# EAGLE design communication_singleSided (EAGLE 5.03)
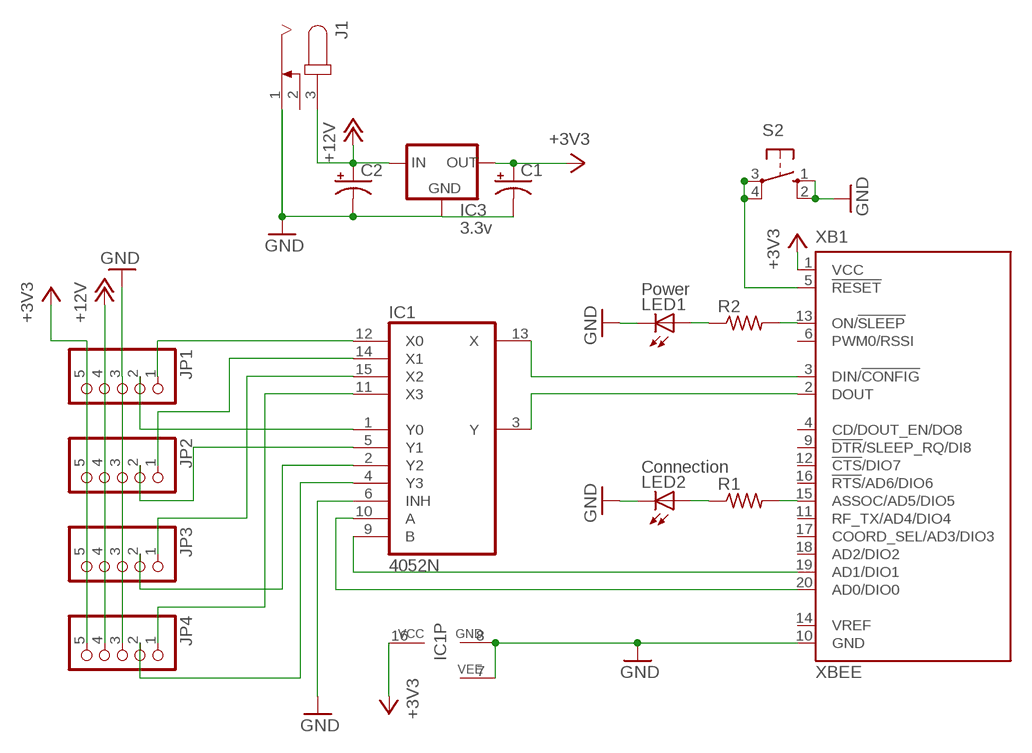
[diagram p0: schematic, sheet 1]

## Parts
C1  CPOL-USE2.5-5  [E2,5-5]
C2  CPOL-USE2.5-5  [E2,5-5]
IC1  4052N  [DIL16]
IC3  3.3v  78XXS  [78XXS]
J1  JACK-PLUG1  [SPC4078]
JP1  PINHD-1X5  [1X05]
JP2  PINHD-1X5  [1X05]
JP3  PINHD-1X5  [1X05]
JP4  PINHD-1X5  [1X05]
LED1  Power  LED3MM  [LED3MM]
LED2  Connection  LED3MM  [LED3MM]
R1  R-US_0207/10  [0207/10]
R2  R-US_0207/10  [0207/10]
S2  10-XX  [B3F-10XX]
XB1  XBEE  [XBEE]

## Nets
+3V3: C1.+ IC1.16(VCC) IC3.OUT JP1.5 JP2.5 JP3.5 JP4.5 XB1.1(VCC)
+12V: C2.+ IC3.IN J1.3 JP1.4 JP2.4 JP3.4 JP4.4
GND: C1.- C2.- IC1.6(INH) IC1.7(VEE) IC1.8(GND) IC3.GND J1.1 JP1.3 JP2.3 JP3.3 JP4.3 LED1.K(C) LED2.K(C) S2.1(S) S2.2(S1) XB1.10(GND)
N$3: IC1.12(X0) JP1.1
N$4: R1.2 XB1.15(ASSOC/AD5/DIO5)
N$5: LED2.A R1.1
N$6: R2.2 XB1.13(ON/!SLEEP)
N$7: LED1.A R2.1
N$8: S2.3(P) S2.4(P1) XB1.5(!RESET)
N$9: IC1.14(X1) JP2.1
N$11: IC1.15(X2) JP3.1
N$12: IC1.11(X3) JP4.1
N$13: IC1.5(Y1) JP2.2
N$14: IC1.1(Y0) JP1.2
N$15: IC1.2(Y2) JP3.2
N$16: IC1.4(Y3) JP4.2
N$17: IC1.13(X) XB1.3(DIN/!CONFIG)
N$18: IC1.3(Y) XB1.2(DOUT)
N$19: IC1.9(B) XB1.19(AD1/DIO1)
N$20: IC1.10(A) XB1.20(AD0/DIO0)
Unconnected: J1.2 XB1.4(CD/DOUT_EN/DO8) XB1.6(PWM0/RSSI) XB1.9(!DTR!/SLEEP_RQ/DI8) XB1.11(RF_TX/AD4/DIO4) XB1.12(!CTS!/DIO7) XB1.14(VREF) XB1.16(!RTS!/AD6/DIO6) XB1.17(COORD_SEL/AD3/DIO3) XB1.18(AD2/DIO2)

## Library data of the parts
C1 C2 = rcl:CPOL-US: POLARIZED CAPACITOR, American symbol
IC1 = 40xx:4052: Dual 4-channel ANALOG MULTIPLEXER
IC3 = v-reg:78XXS: VOLTAGE REGULATOR
J1 = con-jack:JACK-PLUG: DC POWER JACK Power Jack, DC, Right Angle, Through Hole, Rated 5A at 16VDC, PC Terminals Distributor: Farnell (www.Farnell.de) Drawing: 84N1161.pdf / 84N1162.pdf Manufacturer: SPC Technology (www.spctechnology.com) Type: SPC4077 / SPC 4078
JP1-JP4 = pinhead:PINHD-1X5: PIN HEADER
LED1 LED2 = led:LED: LED OSRAM: - CHIPLED LG R971, LG N971, LY N971, LG Q971, LY Q971, LO R971, LY R971 LH N974, LH R974 LS Q976, LO Q976, LY Q976 LO Q996 - Hyper CHIPLED LW Q18S LB Q993, LB Q99A, LB R99A - SideLED LS A670, LO A670, LY A670, LG A670, LP A670 LB A673, LV A673, LT A673, LW A673 LH A674 LY A675 LS A676, LA A676, LO A676, LY A676, LW A676 LS A679, LY A679, LG A679 - Hyper Micro SIDELED® LS Y876, LA Y876, LO Y876, LY Y876 LT Y87S - SmartLED LW L88C, LW L88S LB L89C, LB L89S, LG L890 LS L89K, LO L89K, LY L89K LS L896, LA L896, LO L896, LY L896 - TOPLED LS T670, LO T670, LY T670, LG T670, LP T670 LSG T670, LSP T670, LSY T670, LOP T670, LYG T670 LG T671, LOG T671, LSG T671 LB T673, LV T673, LT T673, LW T673 LH T674 LS T676, LA T676, LO T676, LY T676, LB T676, LH T676, LSB T676, LW T676 LB T67C, LV T67C, LT T67C, LS T67K, LO T67K, LY T67K, LW E67C LS E67B, LA E67B, LO E67B, LY E67B, LB E67C, LV E67C, LT E67C LW T67C LS T679, LY T679, LG T679 LS T770, LO T770, LY T770, LG T770, LP T770 LB T773, LV T773, LT T773, LW T773 LH T774 LS E675, LA E675, LY E675, LS T675 LS T776, LA T776, LO T776, LY T776, LB T776 LHGB T686 LT T68C, LB T68C - Hyper Mini TOPLED® LB M676 - Mini TOPLED Santana® LG M470 LS M47K, LO M47K, LY M47K Source: http://www.osram.convergy.de LUXEON: - LUMILED® LXK2-PW12-R00, LXK2-PW12-S00, LXK2-PW14-U00, LXK2-PW14-V00 LXK2-PM12-R00, LXK2-PM12-S00, LXK2-PM14-U00 LXK2-PE12-Q00, LXK2-PE12-R00, LXK2-PE12-S00, LXK2-PE14-T00, LXK2-PE14-U00 LXK2-PB12-K00, LXK2-PB12-L00, LXK2-PB12-M00, LXK2-PB14-N00, LXK2-PB14-P00, LXK2-PB14-Q00 LXK2-PR12-L00, LXK2-PR12-M00, LXK2-PR14-Q00, LXK2-PR14-R00 LXK2-PD12-Q00, LXK2-PD12-R00, LXK2-PD12-S00 LXK2-PH12-R00, LXK2-PH12-S00 LXK2-PL12-P00, LXK2-PL12-Q00, LXK2-PL12-R00 Source: www.luxeon.com KINGBRIGHT: KA-3528ASYC Source: www.kingbright.com
R1 R2 = resistor:R-US_: RESISTOR, American symbol
S2 = switch-omron:10-XX: OMRON SWITCH
XB1 = maxstream:XBEE: XBee (TM) /XBee-PRO(TM) OEM RF Modules Source: MaxStream, Inc. xbee_productmanual.pdf

## Board
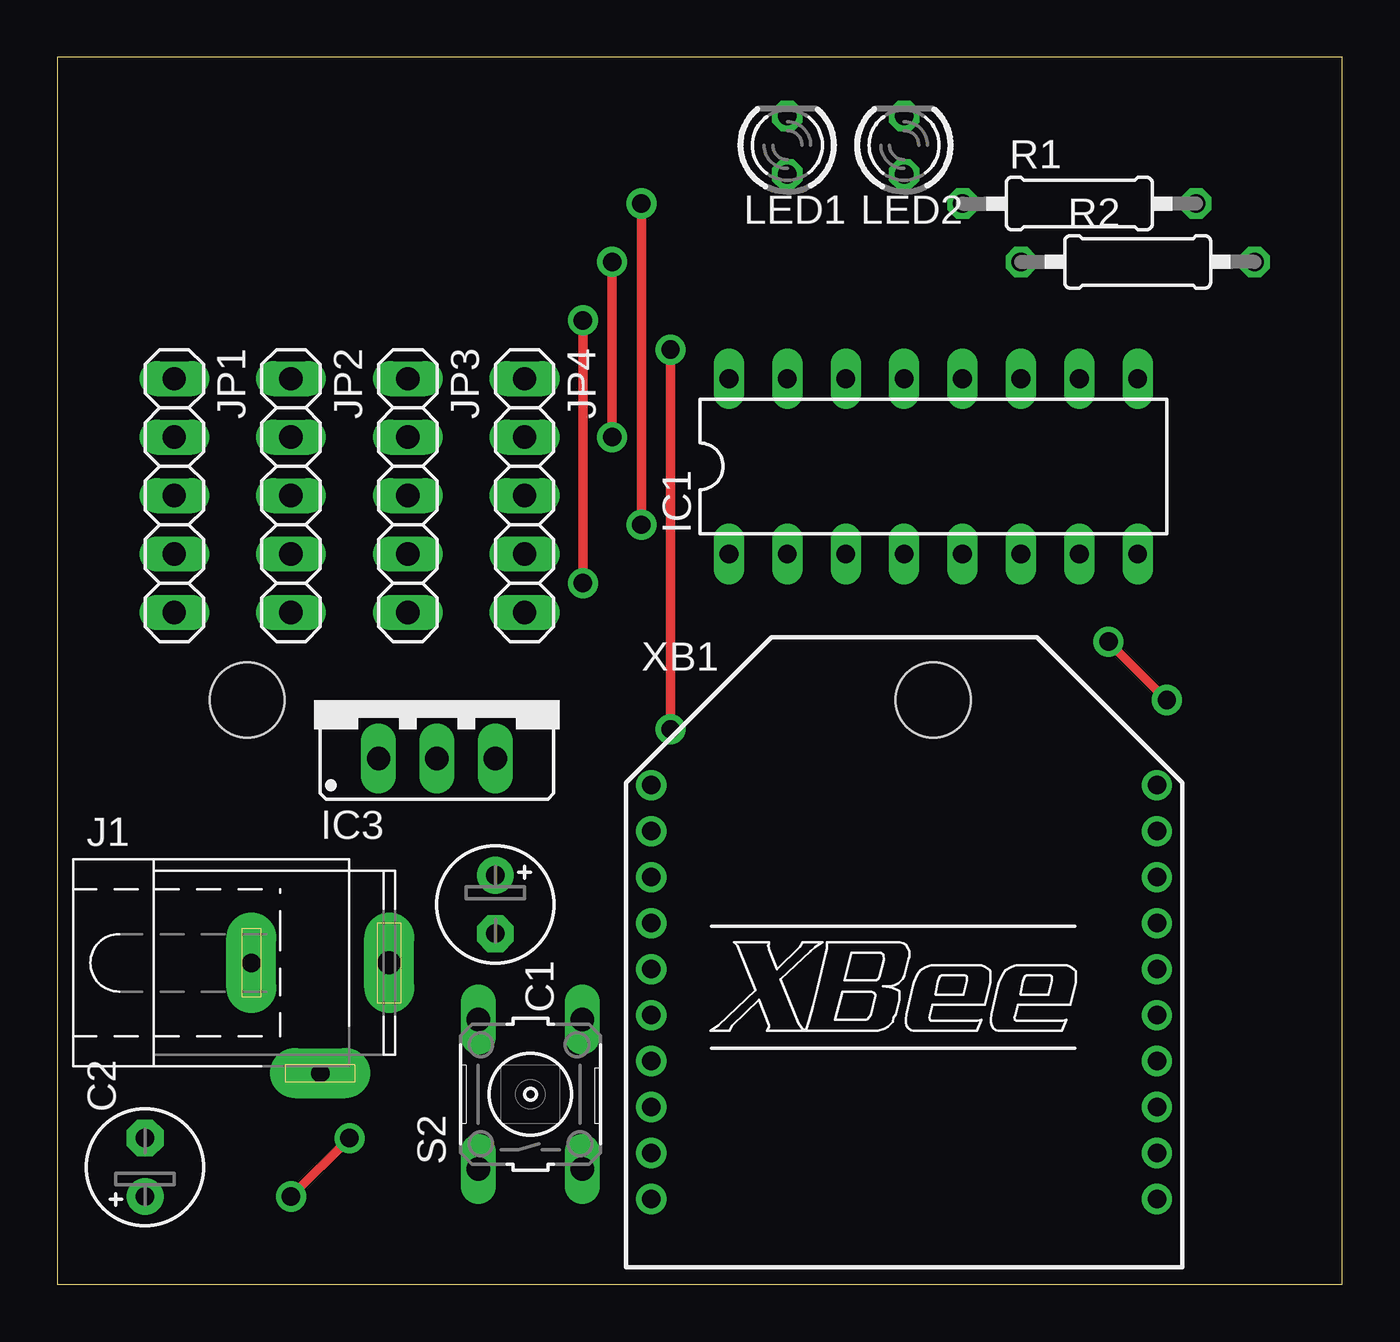
[diagram p1: board, top side]
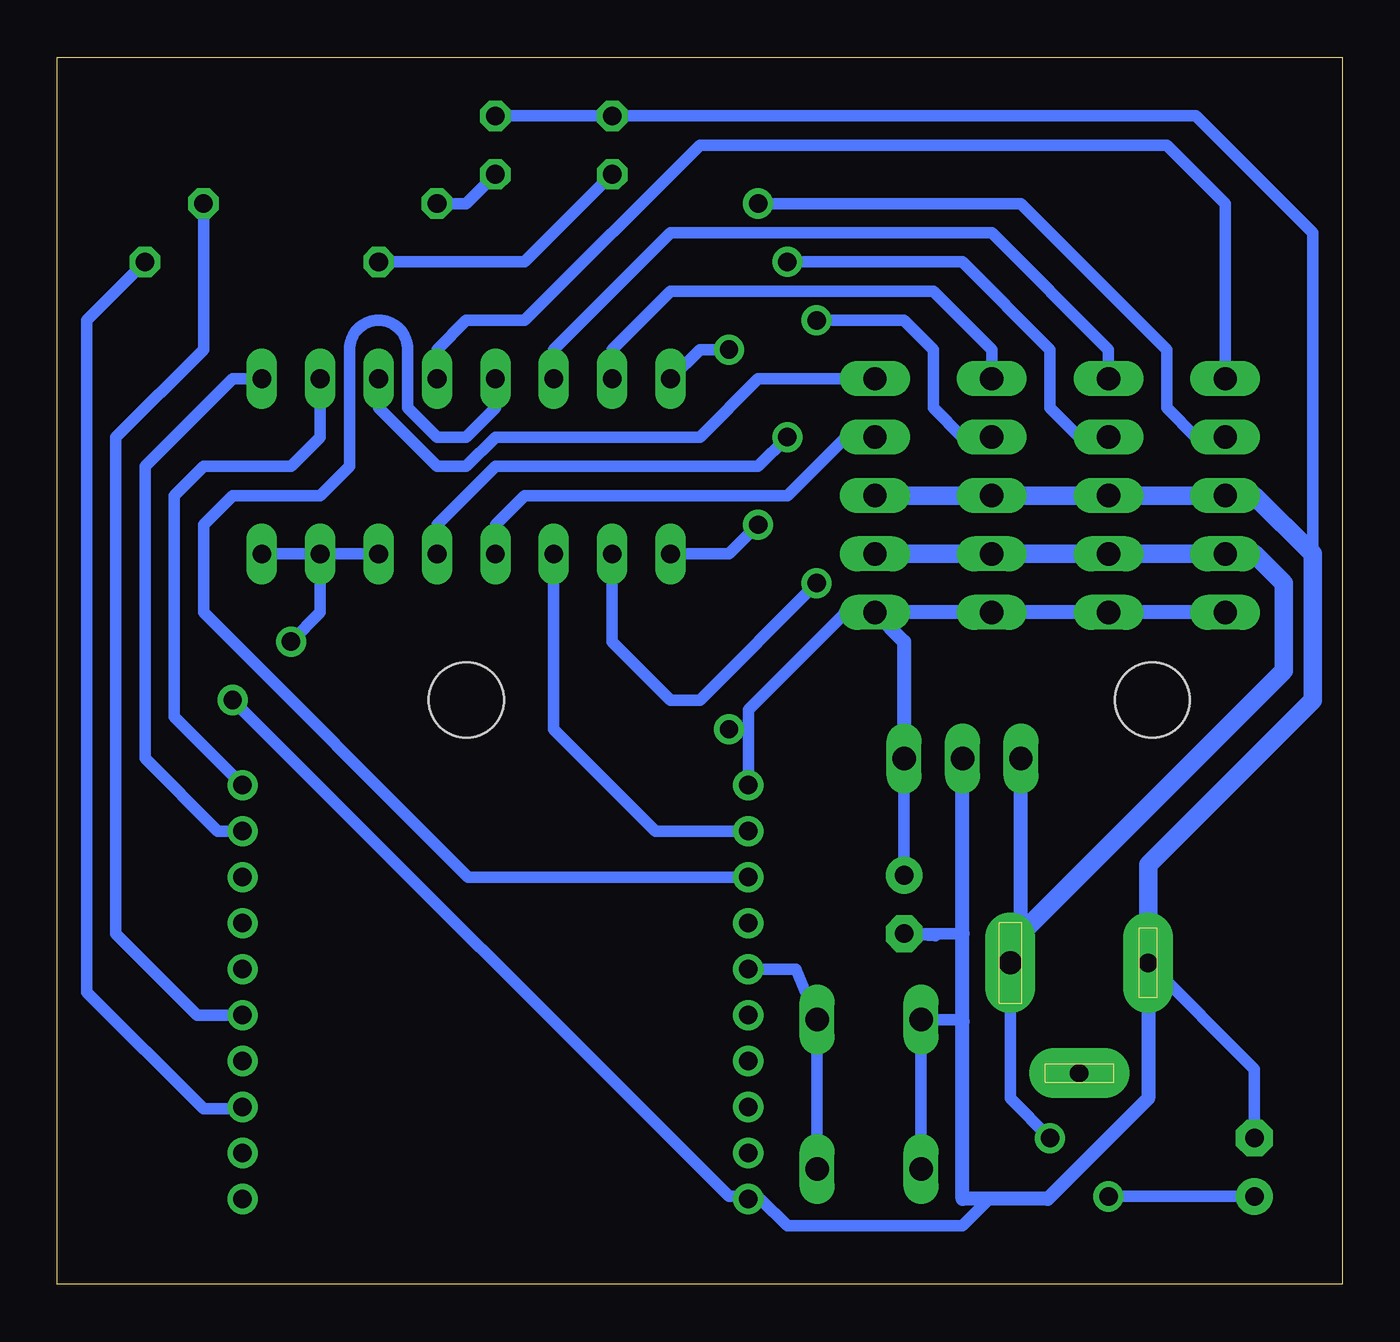
[diagram p2: board, bottom side, seen from below]

Size 55.88 x 53.34 mm. Coordinates in mm from the lower left corner, seen from the top.
Outline: 0,0 55.88,0 55.88,53.34 0,53.34 0,0
Copper layers (1*16): Top 0.035mm / dielectric 1.5mm / Bottom 0.035mm
Design rules "default *": minimum track width 10mil, minimum drill 24mil, track to track 8mil, track to pad 8mil, pad to pad 8mil, via to via 8mil, smd to smd 8mil, copper to edge 40mil, drill to drill 8mil, minimum pad ring 10mil, minimum via ring 10mil, stop-mask expansion 4mil, vias tented up to drill 0mil, thermal gap 10mil
Holes 3.26 mm at 8.26,25.4 38.1,25.4

### Footprints (pad centres in the part's own frame; a part is rotated, then mirrored left to right if it is on the bottom)
E2,5-5 = drill 0.813 pad 1.6 round: + -1.27,0 | drill 0.813 pad 1.6 octagon: - 1.27,0
DIL16 = drill 0.813 long: 1 -8.89,-3.81; 2 -6.35,-3.81; 3 -3.81,-3.81; 4 -1.27,-3.81; 5 1.27,-3.81; 6 3.81,-3.81; 7 6.35,-3.81; 8 8.89,-3.81; 9 8.89,3.81; 10 6.35,3.81; 11 3.81,3.81; 12 1.27,3.81; 13 -1.27,3.81; 14 -3.81,3.81; 15 -6.35,3.81; 16 -8.89,3.81
78XXS = drill 1.016 long: GND 0,-2.54; IN -2.54,-2.54; OUT 2.54,-2.54
SPC4078 = drill 0.8 pad 2.184 long: 1 -3,0; 2 0,-4.8 | drill 1 pad 2.184 long: 3 3,0
1X05 = drill 1.016 long: 1 -5.08,0; 2 -2.54,0; 3 0,0; 4 2.54,0; 5 5.08,0
LED3MM = drill 0.813 octagon: A -1.27,0; K 1.27,0
0207/10 = drill 0.813 octagon: 1 -5.08,0; 2 5.08,0
B3F-10XX = drill 1.016 long: 1 -3.251,2.261; 2 3.251,2.261; 3 -3.251,-2.261; 4 3.251,-2.261
XBEE = drill 0.8 pad 1.27 round: 1 -11,9; 2 -11,7; 3 -11,5; 4 -11,3; 5 -11,1; 6 -11,-1; 7 -11,-3; 8 -11,-5; 9 -11,-7; 10 -11,-9; 11 11,-9; 12 11,-7; 13 11,-5; 14 11,-3; 15 11,-1; 16 11,1; 17 11,3; 18 11,5; 19 11,7; 20 11,9

### Placement (x,y rotation side)
C1  19.05,16.51 270 top
C2  3.81,5.08 90 top
IC1  38.1,35.56 0 top
IC3  16.51,25.4 0 top
J1  11.43,13.97 0 top
JP1  5.08,34.29 270 top
JP2  10.16,34.29 270 top
JP3  15.24,34.29 270 top
JP4  20.32,34.29 270 top
LED1  31.75,49.53 90 top
LED2  36.83,49.53 90 top
R1  44.45,46.99 0 top
R2  46.99,44.45 0 top
S2  20.57,8.26 90 top
XB1  36.83,12.7 0 top

### Tracks (layer width: path | path; a pad name or v marks a point on that pad's centre or on a via)
+3V3  (via drill 0.8)
  Top 0.406: v26.67,24.13 v26.67,40.64
  Bottom 0.406: JP1.5 JP2.5 | 21.59,29.21 JP4.5
  Bottom 0.508: IC3.OUT C1.+ | 25.83,24.13 25.83,24.97 21.59,29.21 | IC1.16 27.94,40.64 v26.67,40.64 | 25.83,24.13 v26.67,24.13 | 25.83,24.13 XB1.1
  Bottom 0.61: JP4.5 19.05,27.94 IC3.OUT | JP1.5 JP2.5 JP3.5 21.59,29.21
+12V  (via drill 0.8)
  Top 0.406: v10.16,3.81 v12.7,6.35
  Bottom 0.508: C2.+ v10.16,3.81 | v12.7,6.35 14.43,8.08 J1.3
  Bottom 0.61: 13.97,15.24 IC3.IN
  Bottom 0.813: JP4.4 JP3.4 JP2.4 JP1.4 3.81,31.75 2.54,30.48 2.54,26.67 13.97,15.24 14.43,14.78 J1.3
GND  (via drill 0.8)
  Top 0.406: v48.26,25.4 v45.72,27.94
  Bottom 0.406: 16.51,3.71 15.34,3.71 | 16.51,11.43 16.51,11.51
  Bottom 0.508: 1.27,31.75 1.27,45.72 6.35,50.8 LED1.K LED2.K | IC1.7 IC1.8 | 16.51,15.24 C1.- 17.68,15.14 | C2.- 3.81,9.35 J1.1 | 15.34,3.71 16.51,2.54 24.13,2.54 25.29,3.7 XB1.10 | 16.51,11.51 S2.2 S2.1 | IC1.7 IC1.6 | v45.72,27.94 44.45,29.21 IC1.7 | XB1.10 25.94,3.81 26.67,3.81 v48.26,25.4 | XB1.10 25.72,3.81 25.4,3.81
  Bottom 0.61: J1.1 8.43,8.08 12.8,3.71 16.51,3.71 16.51,11.43 16.51,15.24 IC3.GND
  Bottom 0.813: JP4.3 JP3.3 JP2.3 JP1.3 3.81,34.29 1.27,31.75 1.27,25.4 8.43,18.24 J1.1
N$3
  Bottom 0.508: JP1.1 5.08,46.99 7.62,49.53 27.94,49.53 35.56,41.91 38.1,41.91 39.37,40.64 IC1.12
N$4
  Bottom 0.508: R1.2 49.53,40.64 53.34,36.83 53.34,15.24 49.8,11.7 XB1.15
N$5
  Bottom 0.508: LED2.A 38.1,46.99 R1.1
N$6
  Bottom 0.508: R2.2 54.61,41.91 54.61,12.7 49.53,7.62 47.91,7.62 XB1.13
N$7
  Bottom 0.508: LED1.A 35.56,44.45 R2.1
N$8
  Bottom 0.508: S2.3 S2.4 23.76,13.7 XB1.5
N$9
  Bottom 0.508: JP2.1 10.16,40.64 15.24,45.72 27.94,45.72 29.21,45.72 34.29,40.64 IC1.14
N$11
  Bottom 0.508: JP3.1 15.24,40.64 17.78,43.18 29.21,43.18 31.75,40.64 IC1.15
N$12
  Bottom 0.508: JP4.1 25.4,39.37 27.94,36.83 36.83,36.83 38.1,35.56 39.37,35.56 41.91,38.1 IC1.11
N$13  (via drill 0.8)
  Top 0.406: v24.13,44.45 v24.13,36.83
  Bottom 0.508: JP2.2 11.43,36.83 12.7,38.1 12.7,40.64 16.51,44.45 v24.13,44.45 | v24.13,36.83 25.4,35.56 36.83,35.56 39.37,33.02 IC1.5
N$14  (via drill 0.8)
  Top 0.406: v25.4,46.99 v25.4,33.02
  Bottom 0.508: JP1.2 6.35,36.83 7.62,38.1 7.62,40.64 13.97,46.99 v25.4,46.99 | v25.4,33.02 26.67,31.75 IC1.1
N$15  (via drill 0.8)
  Top 0.406: v22.86,41.91 v22.86,30.48
  Bottom 0.508: JP3.2 16.51,36.83 17.78,38.1 17.78,40.64 19.05,41.91 v22.86,41.91 | v22.86,30.48 27.94,25.4 29.21,25.4 31.75,27.94 IC1.2
N$16
  Bottom 0.508: JP4.2 21.59,36.83 24.13,34.29 35.56,34.29 36.83,33.02 IC1.4
N$17
  Bottom 0.508: IC1.13 36.83,38.1 38.1,36.83 39.37,36.83 40.64,38.1 40.64,40.64 arc-90 41.91,41.91 arc-90 43.18,40.64 43.18,35.56 44.45,34.29 48.26,34.29 49.53,33.02 49.53,29.21 38.02,17.7 XB1.3
N$18
  Bottom 0.508: XB1.2 29.86,19.7 34.29,24.13 IC1.3
N$19
  Bottom 0.508: XB1.19 48.91,19.7 52.07,22.86 52.07,34.29 52.07,35.56 48.26,39.37 IC1.9
N$20
  Bottom 0.508: IC1.10 44.45,36.83 45.72,35.56 49.53,35.56 50.8,34.29 50.8,33.02 50.8,24.67 XB1.20

### Text on the board
tValues: Alex Crawford, 2009 | + | 12 volts | Reset